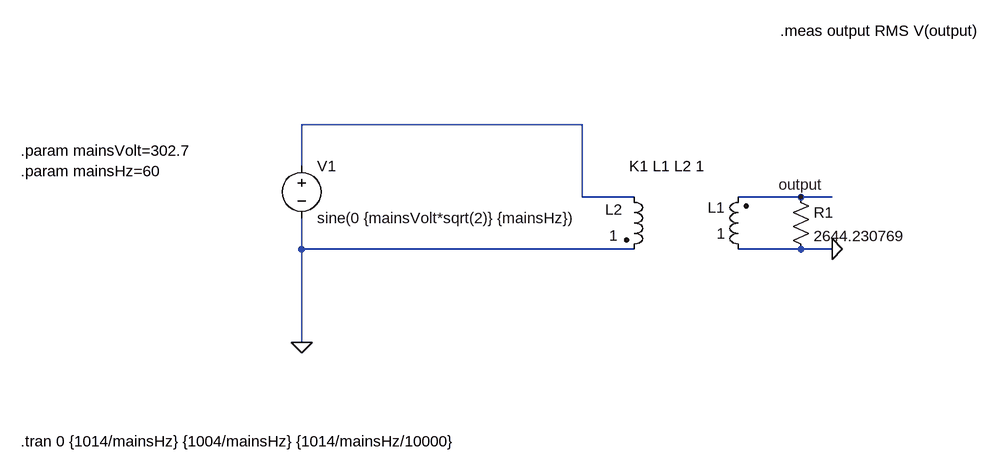
[diagram p0: schematic Inductor.asc]
Inductor.asc, the LTspice schematic file:
Version 4
SHEET 1 1256 680
WIRE 544 32 112 32
WIRE 112 96 112 32
WIRE 544 144 544 32
WIRE 624 144 544 144
WIRE 880 144 784 144
WIRE 928 144 880 144
WIRE 112 224 112 176
WIRE 624 224 112 224
WIRE 880 224 784 224
WIRE 928 224 880 224
WIRE 112 368 112 224
FLAG 112 368 0
FLAG 928 224 0
FLAG 880 144 output
SYMBOL ind2 800 240 R180
WINDOW 0 36 80 Left 2
WINDOW 3 36 40 Left 2
SYMATTR InstName L1
SYMATTR Value 1
SYMATTR Type ind
SYMATTR SpiceLine Rser=232.8
SYMBOL voltage 112 80 R0
WINDOW 123 0 0 Left 0
WINDOW 39 0 0 Left 0
SYMATTR InstName V1
SYMATTR Value sine(0 {mainsVolt*sqrt(2)} {mainsHz})
SYMBOL ind2 608 128 R0
WINDOW 0 -29 35 Left 2
WINDOW 3 -23 75 Left 2
SYMATTR InstName L2
SYMATTR Value 1
SYMATTR Type ind
SYMATTR SpiceLine Rser=6.23
SYMBOL res 864 128 R0
SYMATTR InstName R1
SYMATTR Value 2644.230769
TEXT -320 72 Left 2 !.param mainsVolt=302.7
TEXT -320 104 Left 2 !.param mainsHz=60
TEXT -320 520 Left 2 !.tran 0 {1014/mainsHz} {1004/mainsHz} {1014/mainsHz/10000}
TEXT 616 96 Left 2 !K1 L1 L2 1
TEXT 848 -112 Left 2 !.meas output RMS V(output)

The netlist it stands for:
* Inductor.asc
L1 0 output 1 Rser=232.8
V1 N001 0 sine(0 {mainsVolt*sqrt(2)} {mainsHz})
L2 N001 0 1 Rser=6.23
R1 output 0 2644.230769
.param mainsVolt=302.7
.param mainsHz=60
.tran 0 {1014/mainsHz} {1004/mainsHz} {1014/mainsHz/10000}
K1 L1 L2 1
.meas output RMS V(output)
.backanno
.end